# Altium schematic sheet Remote 8-bit I2C .SchDoc
size A4
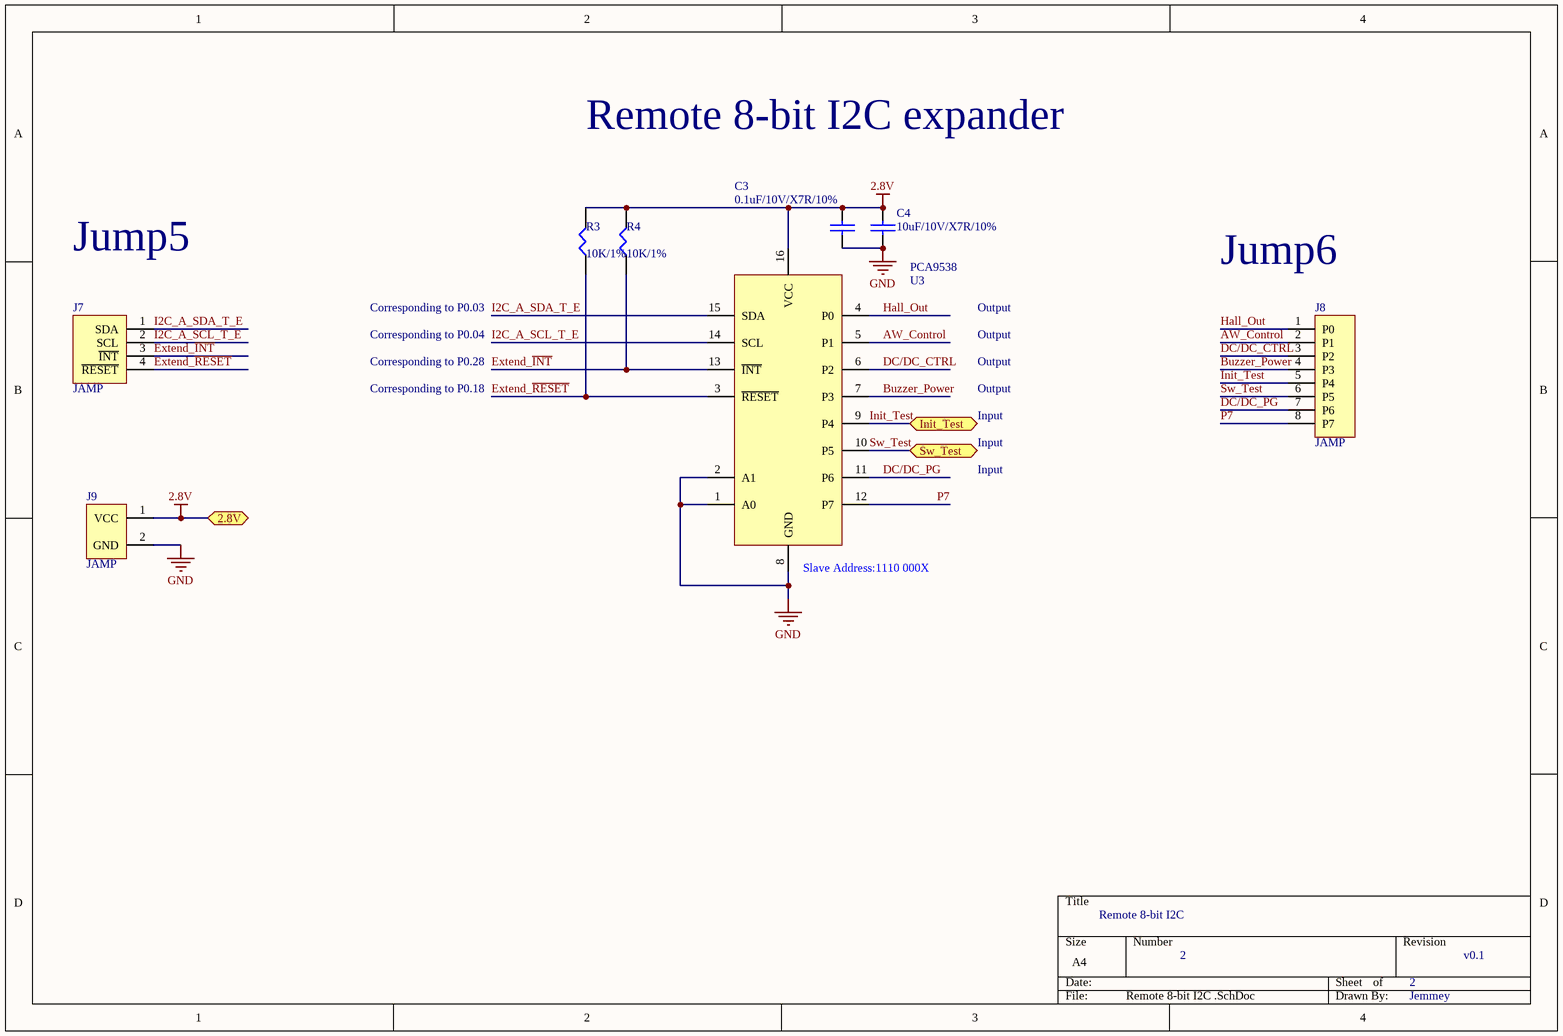
[diagram p0: Remote 8-bit I2C .SchDoc]

## Parts
C3  0.1uF/10V/X7R/10%  [0402C]
C4  10uF/10V/X7R/10%  [0603C]
J7  JAMP  [Debug- 1.27*4]
J8  JAMP  [Debug- 1.27*8]
J9  JAMP  [Debug- 1.27*2]
R3  10K/1%  [0402R]
R4  10K/1%  [0402R]
U3  PCA9538  [TSSOP-16]

## Ports
2.8V, Init_Test, Sw_Test

## Nets
2.8V: C3.1 C4.1 J9.1(VCC) R3.2 R4.2 U3.16(VCC) ; port 2.8V
GND: C3.2 C4.2 J9.2(GND) U3.1(A0) U3.2(A1) U3.8(GND)
AW_Control: J8.2(P1) U3.5(P1)
Buzzer_Power: J8.4(P3) U3.7(P3)
DC/DC_CTRL: J8.3(P2) U3.6(P2)
DC/DC_PG: J8.7(P6) U3.11(P6)
Extend_~{INT}: J7.3(~{INT}) R4.1 U3.13(~{INT})
Extend_~{RESET}: J7.4(~{RESET}) R3.1 U3.3(~{RESET})
Hall_Out: J8.1(P0) U3.4(P0)
I2C_A_SCL_T_E: J7.2(SCL) U3.14(SCL)
I2C_A_SDA_T_E: J7.1(SDA) U3.15(SDA)
Init_Test: J8.5(P4) U3.9(P4) ; port Init_Test
P7: J8.8(P7) U3.12(P7)
Sw_Test: J8.6(P5) U3.10(P5) ; port Sw_Test

## Notes on the sheet
- Remote 8-bit I2C expander
- Jump5
- Corresponding to P0.03
- Output
- Jump6
- Corresponding to P0.28
- Corresponding to P0.04
- Corresponding to P0.18
- Input
- (near U3) Slave Address:1110 000X
- Remote 8-bit I2C
- 2
- v0.1
- Jemmey

## Library data of the parts
C3 = CAP: 厂家：Murata，型号：GRM155R71A104KA01D
C4 = CAP: 厂家：Murata，型号：GRM188R61A106KE69D
J7-J9 = JAMP: 厂家：暂定，型号：暂定
R3 R4 = RES1: 厂家：Yageo，型号：RC0402FR-0710KL
U3 = PCA9538: 厂家：TI，型号：PCA9538 Remote 8-bit I2C with interrupt output